# Altium schematic sheet SWITCH.SchDoc
size A; SheetNumber: 1; SheetTotal: 11
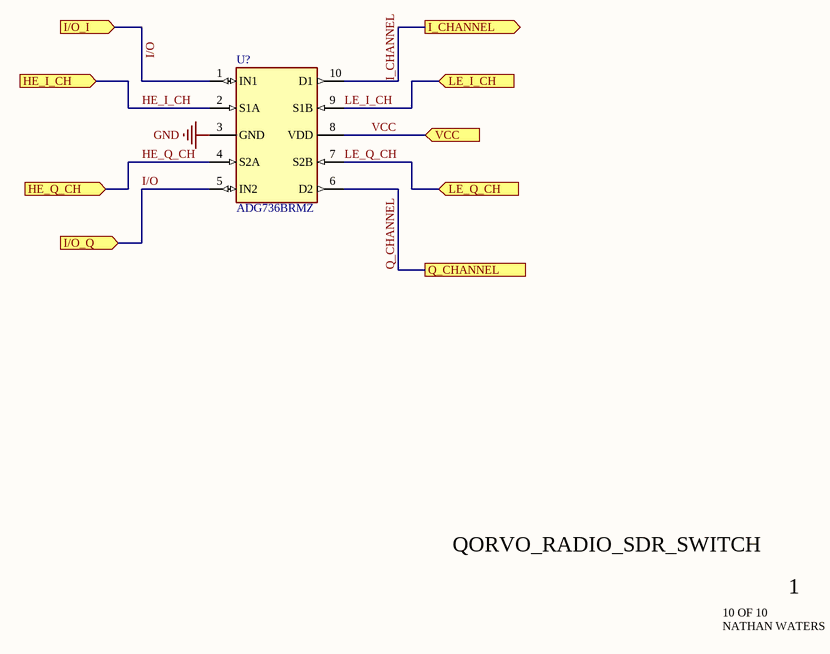
[diagram p0: SWITCH.SchDoc]

## Parts
U?  ADG736BRMZ  [ADG736BRMZ]

## Ports
HE_I_CH (in), HE_Q_CH (in), I/O_I (in), I/O_Q (in), I_CHANNEL (out), LE_I_CH (in), LE_Q_CH (in), Q_CHANNEL, VCC (in, see 0.9V REG[3B], 3.3v REG[3B], AA[1B], AA[2B], HE LNA[3A], HE Mixer[3C], LE LNA[3A], LE Mixer[3C], LPF[1B])

## Nets
GND: U?.3(GND)
HE_I_CH: U?.2(S1A) ; port HE_I_CH
HE_Q_CH: U?.4(S2A) ; port HE_Q_CH
I/O: U?.1(IN1) U?.5(IN2) ; port I/O_I, port I/O_Q
I_CHANNEL: U?.10(D1) ; port I_CHANNEL
LE_I_CH: U?.9(S1B) ; port LE_I_CH
LE_Q_CH: U?.7(S2B) ; port LE_Q_CH
Q_CHANNEL: U?.6(D2) ; port Q_CHANNEL
VCC: U?.8(VDD) ; port VCC

## Notes on the sheet
- QORVO_RADIO_SDR_SWITCH
- 10 OF 10
- 1
- NATHAN WATERS

## Library data of the parts
U? = ADG736BRMZ: Switch; Manufacturer_Name: Analog Devices; Manufacturer_Part_Number: ADG736BRMZ; Datasheet Link: http://www.analog.com/media/en/technical-documentation/data-sheets/ADG736.pdf